# EAGLE design 2021 Deployment REVB (EAGLE 9.6.2)

## Sheet 1 of 2: Template
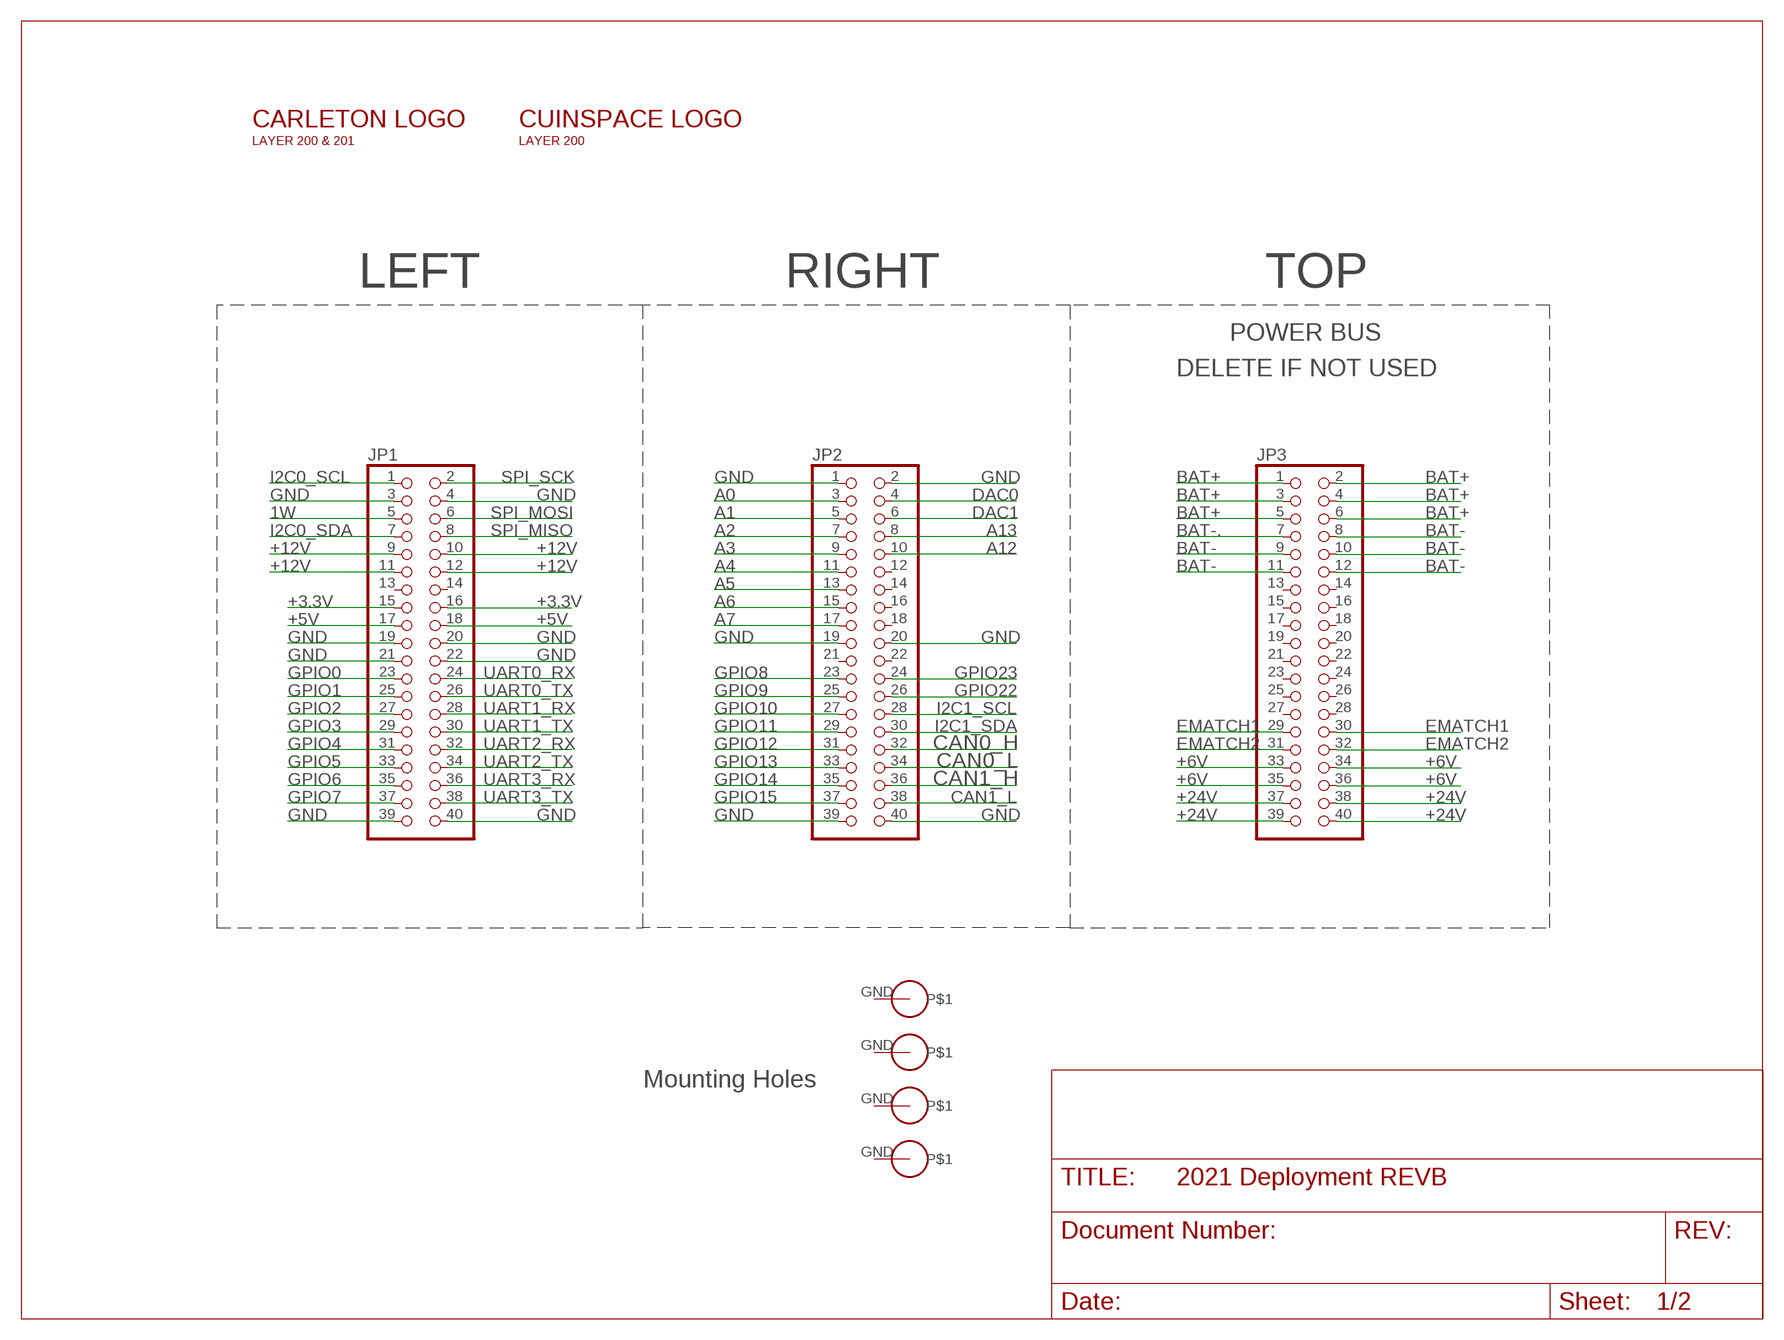
[diagram p0: schematic, sheet 1]

### Parts
$$U$1  PS/104-MOUNTING-HOLE  [PC/104-MOUNTING-HOLE]
JP1  PINHD-2X20  [2X20]
JP2  PINHD-2X20  [2X20]
JP3  PINHD-2X20  [2X20]
U$1  PS/104-MOUNTING-HOLE  [PC/104-MOUNTING-HOLE]
U$2  PS/104-MOUNTING-HOLE  [PC/104-MOUNTING-HOLE]
U$3  PS/104-MOUNTING-HOLE  [PC/104-MOUNTING-HOLE]
U$4  CARLETON3CM  [CARLETONU_3CM]
U$6  INSPACE3CM_L  [INSPACE_3CM_LETTERS]

### Nets
1W: JP1.5
+3.3V: JP1.15 JP1.16
+5V: JP1.17 JP1.18
+6V: JP3.33 JP3.34 JP3.35 JP3.36
+12V: JP1.9 JP1.10 JP1.11 JP1.12 ; also sheet 2
+24V: JP3.37 JP3.38 JP3.39 JP3.40
A0: JP2.3
A1: JP2.5
A2: JP2.7
A3: JP2.9
A4: JP2.11
A5: JP2.13
A6: JP2.15
A7: JP2.17
A12: JP2.10
A13: JP2.8
BAT+: JP3.1 JP3.2 JP3.3 JP3.4 JP3.5 JP3.6
BAT-: JP3.8 JP3.9 JP3.10 JP3.11 JP3.12
BAT-.: JP3.7
CAN0_H: JP2.32
CAN0_L: JP2.34
CAN1_H: JP2.36
CAN1_L: JP2.38
DAC0: JP2.4
DAC1: JP2.6
EMATCH1: JP3.29 JP3.30 ; also sheet 2
EMATCH2: JP3.31 JP3.32 ; also sheet 2
GND [New Class]: JP1.3 JP1.4 JP1.19 JP1.20 JP1.21 JP1.22 JP1.39 JP1.40 JP2.1 JP2.2 JP2.19 JP2.20 JP2.39 JP2.40 ; also sheet 2
GPIO0: JP1.23
GPIO1: JP1.25
GPIO2: JP1.27
GPIO3: JP1.29
GPIO4: JP1.31
GPIO5: JP1.33
GPIO6: JP1.35
GPIO7: JP1.37
GPIO8: JP2.23
GPIO9: JP2.25
GPIO10: JP2.27
GPIO11: JP2.29
GPIO12: JP2.31
GPIO13: JP2.33
GPIO14: JP2.35
GPIO15: JP2.37
GPIO22: JP2.26 ; also sheet 2
GPIO23: JP2.24 ; also sheet 2
I2C0_SCL: JP1.1
I2C0_SDA: JP1.7
I2C1_SCL: JP2.28
I2C1_SDA: JP2.30
SPI_MISO: JP1.8
SPI_MOSI: JP1.6
SPI_SCK: JP1.2
UART0_RX: JP1.24
UART0_TX: JP1.26
UART1_RX: JP1.28
UART1_TX: JP1.30
UART2_RX: JP1.32
UART2_TX: JP1.34
UART3_RX: JP1.36
UART3_TX: JP1.38
Unconnected: $$U$1.GND JP1.13 JP1.14 JP2.12 JP2.14 JP2.16 JP2.18 JP2.21 JP2.22 JP3.13 JP3.14 JP3.15 JP3.16 JP3.17 JP3.18 JP3.19 JP3.20 JP3.21 JP3.22 JP3.23 JP3.24 JP3.25 JP3.26 JP3.27 JP3.28 U$1.GND U$2.GND U$3.GND

### Notes on the sheet
- LEFT | RIGHT | TOP
- POWER BUS
- DELETE IF NOT USED
- Mounting Holes

## Sheet 2 of 2
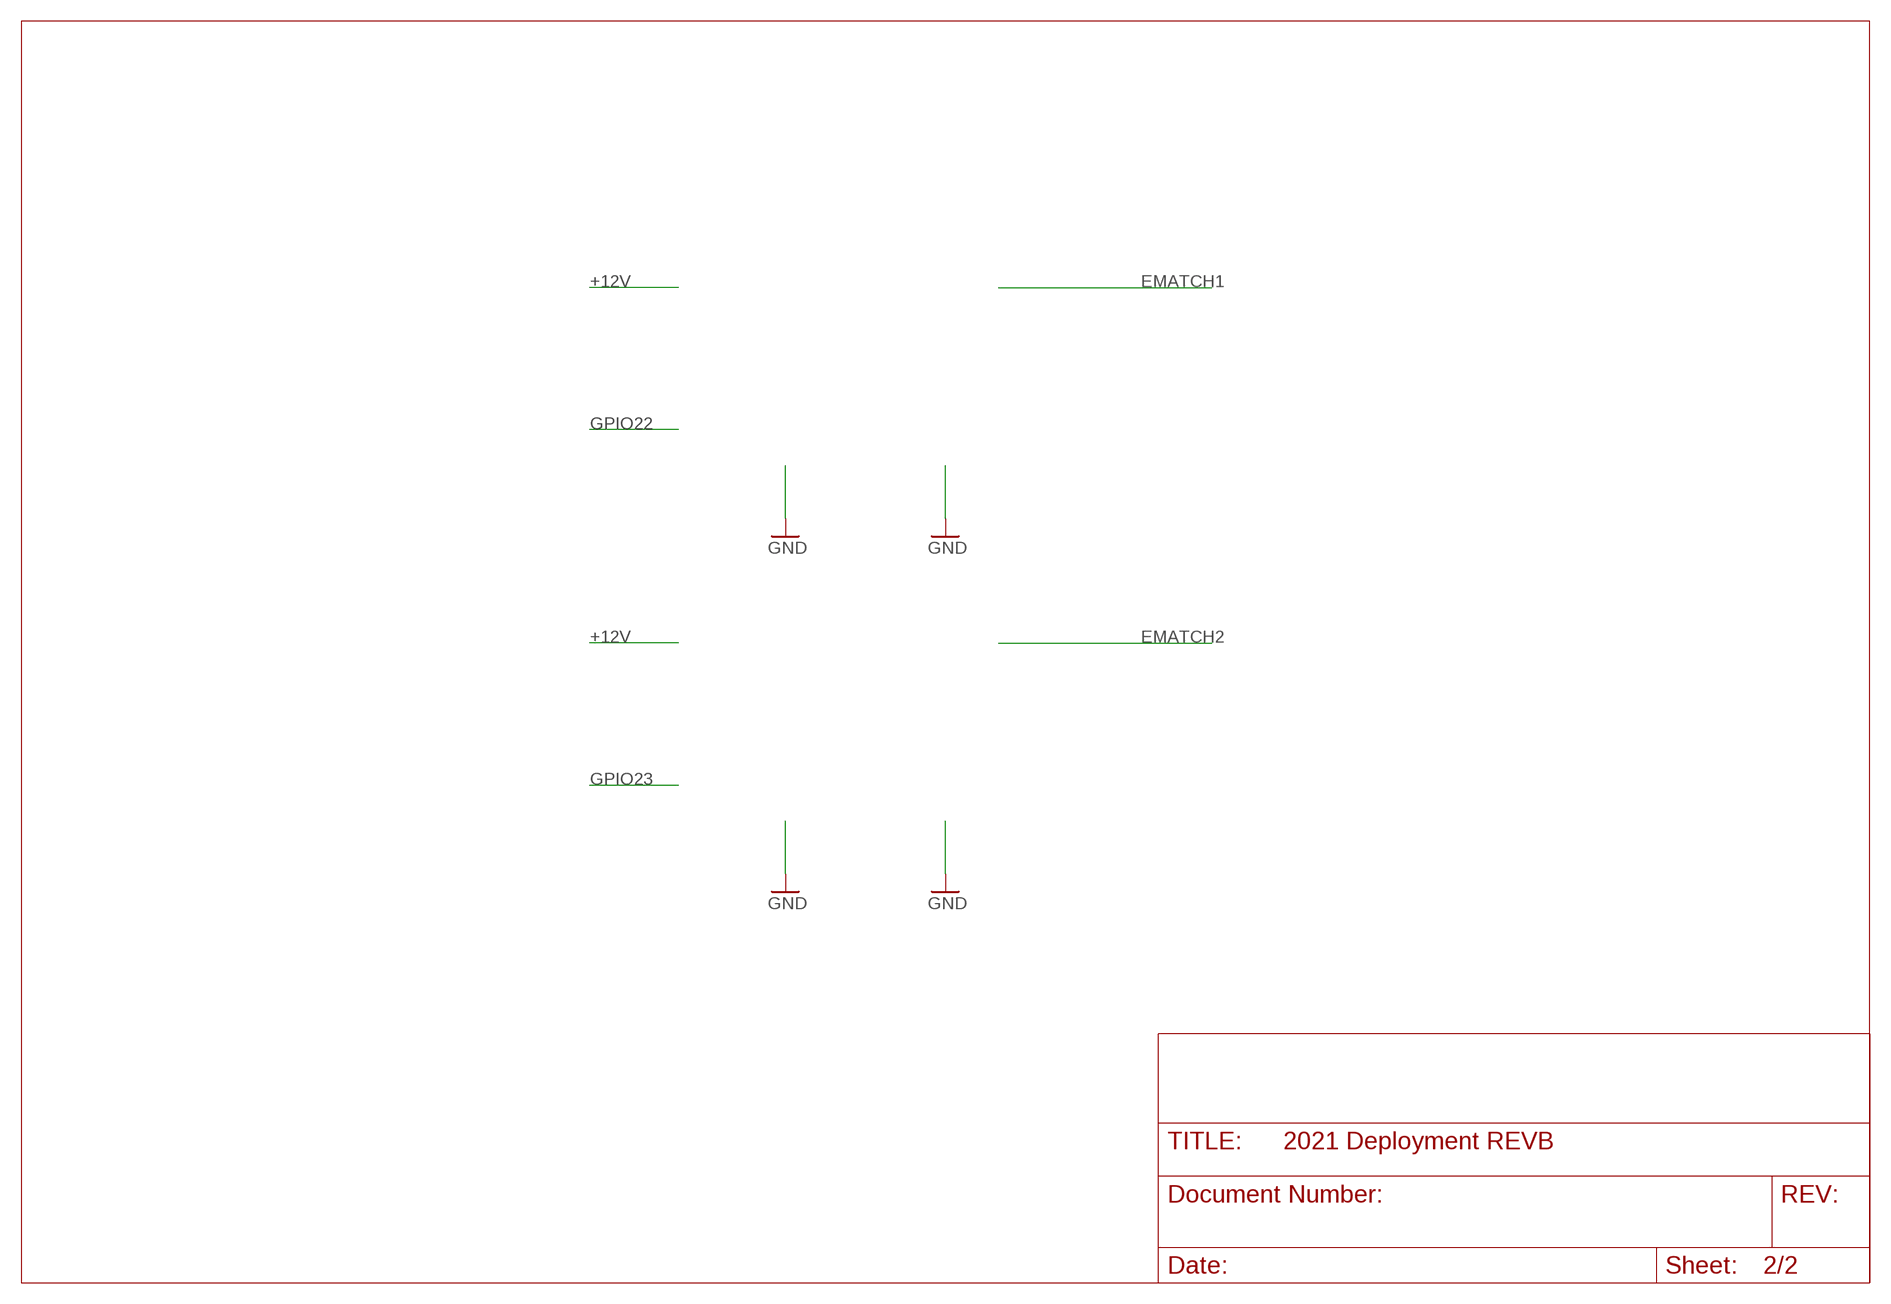
[diagram p1: schematic, sheet 2]

## Library data of the parts
$$U$1 U$1-U$3 = CU inSpace 2019 Parts:PS/104-MOUNTING-HOLE: Mounting hole for PC/104 board.
JP1-JP3 = pinhead:PINHD-2X20: PIN HEADER
U$4 = Logos:CARLETON
U$6 = Logos:INSPACE

## Net classes
2 diff pairs: width 0.254 mm

## Board
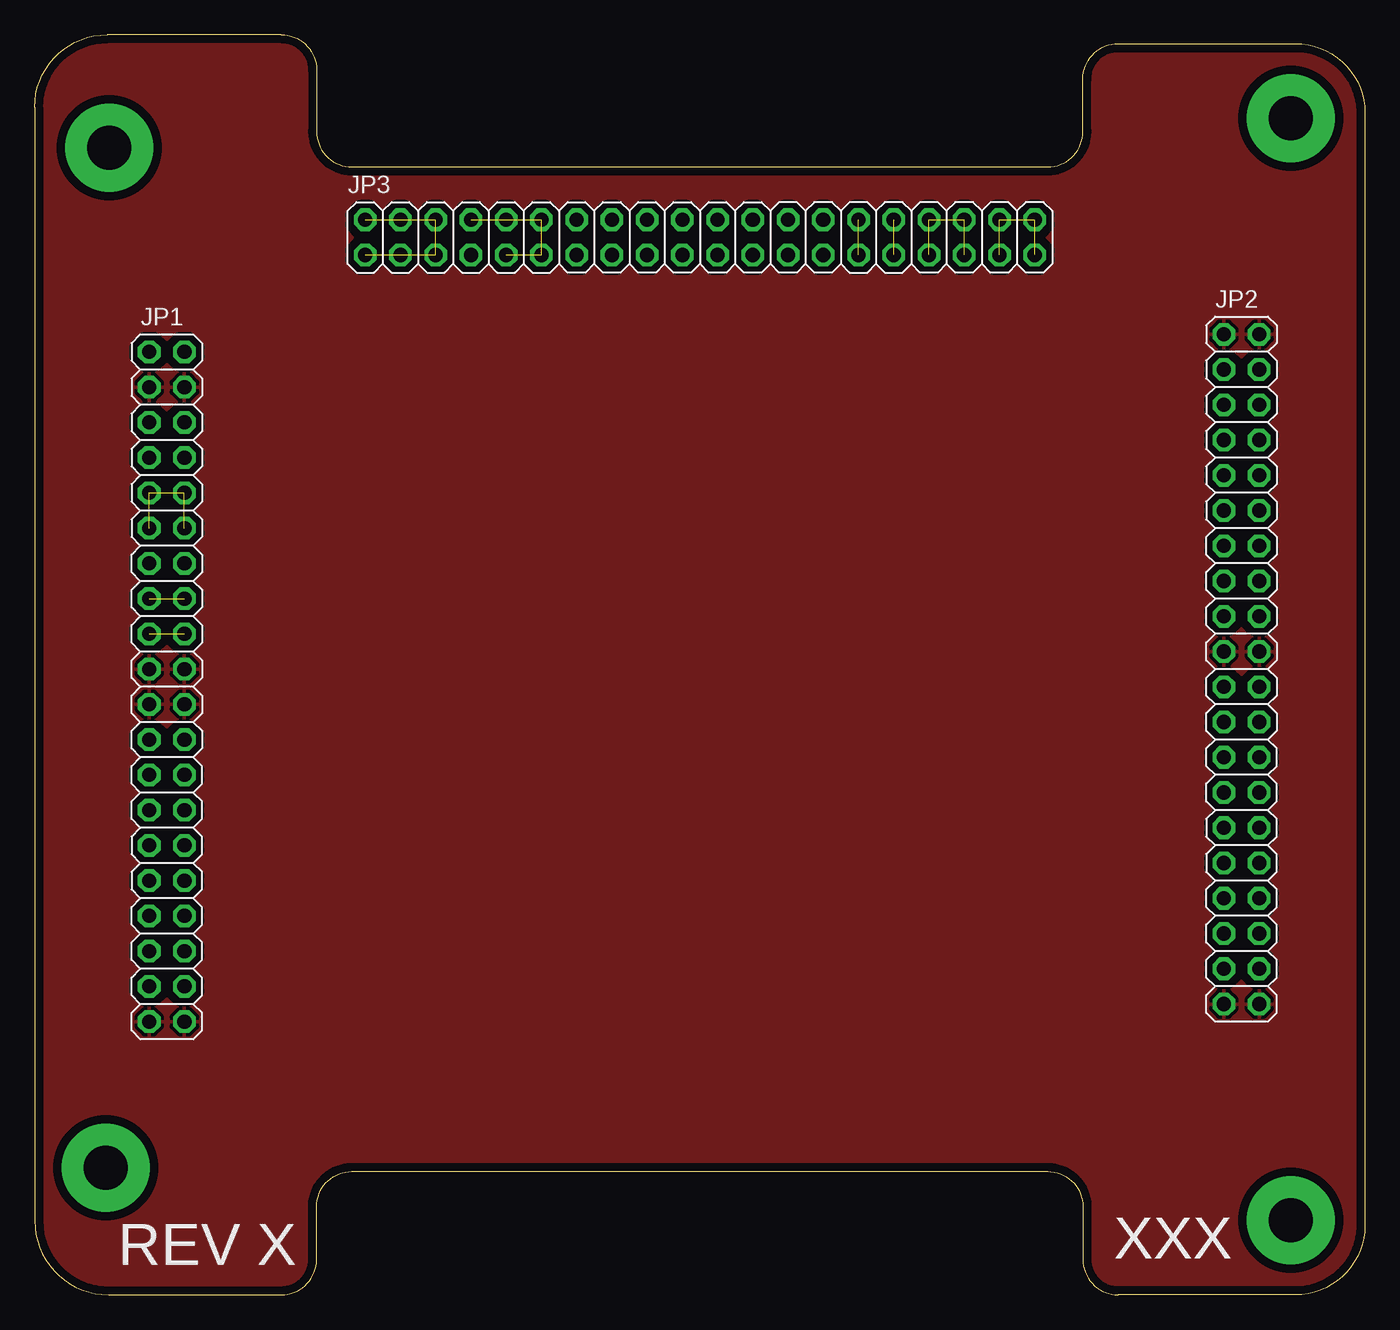
[diagram p2: board, top side]
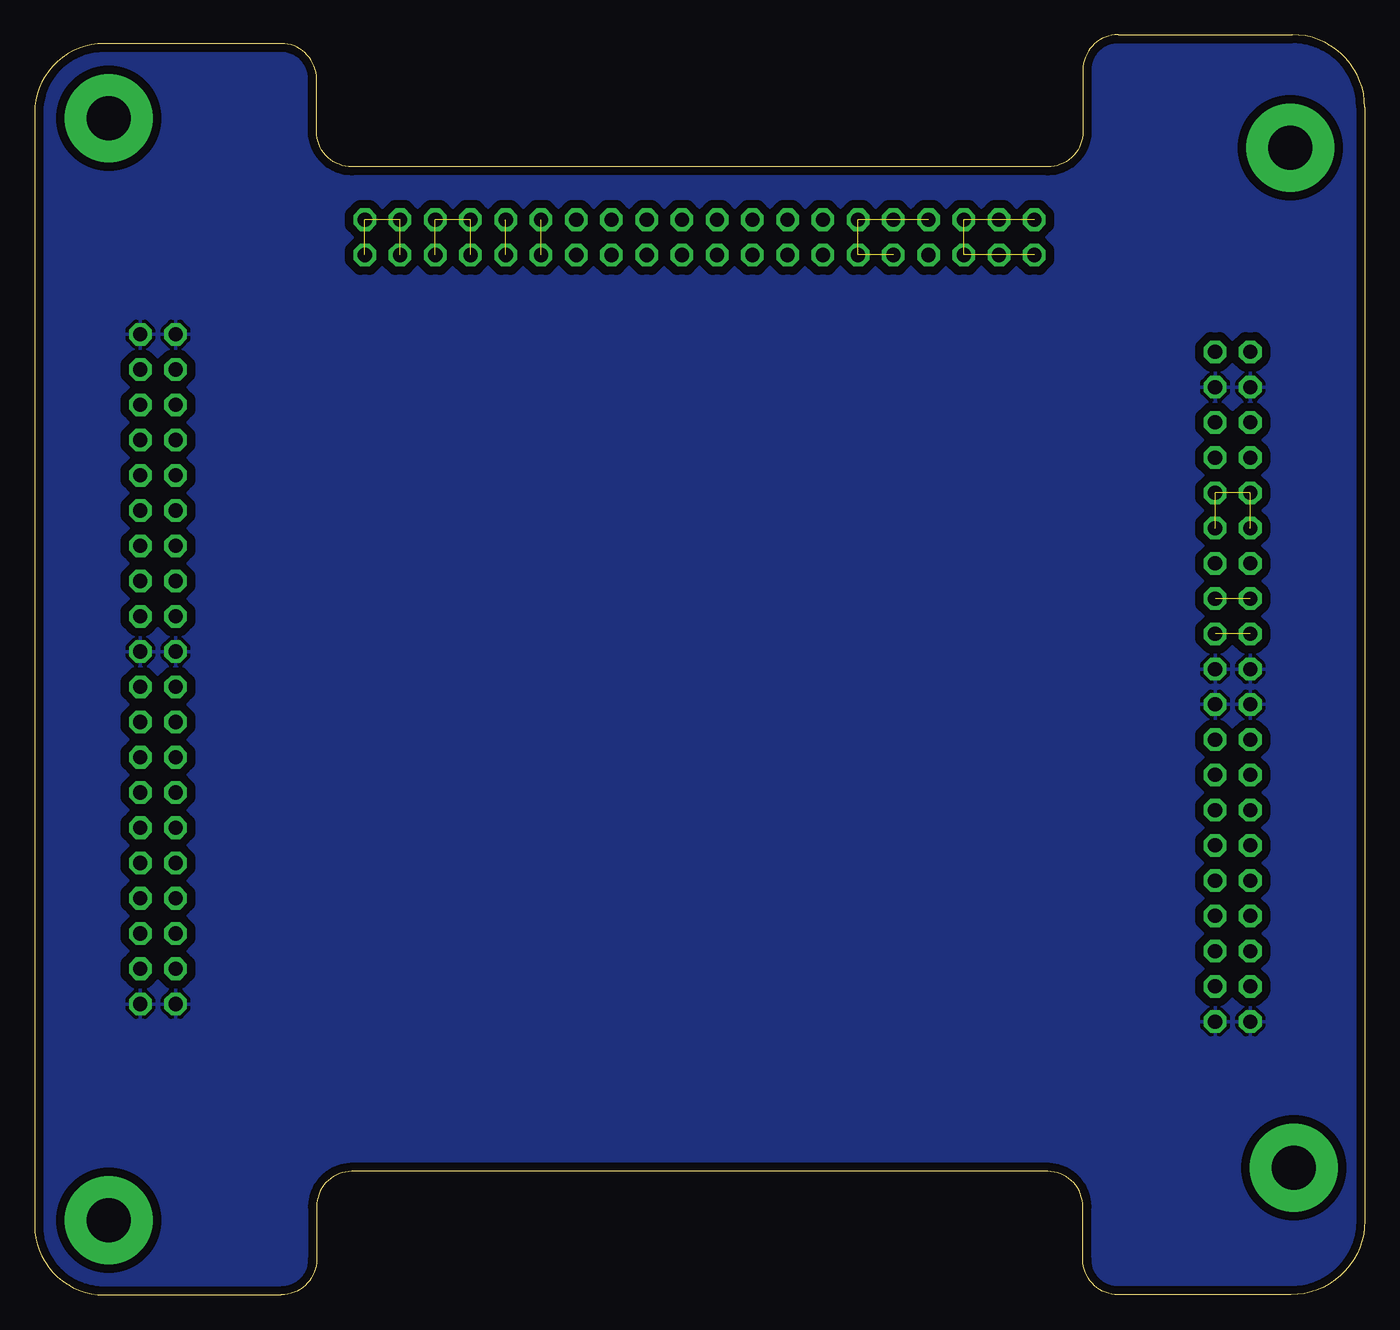
[diagram p3: board, bottom side, seen from below]

Size 95.89 x 90.81 mm. Coordinates in mm from the lower left corner, seen from the top.
Outline: 0,85.57 0,5.33 arc90 5.33,0 17.78,0 arc90 20.32,2.54 20.32,6.35 arc-90 22.86,8.89 73.03,8.89 arc-90 75.56,6.35 75.56,2.54 arc90 78.11,0 90.89,0 arc90 95.89,5 95.89,85.17 arc90 90.89,90.17 78.11,90.17 arc90 75.56,87.63 75.56,83.82 arc-90 73.03,81.28 22.86,81.28 arc-90 20.32,83.82 20.32,88.27 arc90 17.78,90.81 5.23,90.81 arc90 0,85.57
Copper layers (1*16): Top 0.035mm / dielectric 1.53mm / Bottom 0.035mm
Design rules "JLC 2 Layer": minimum track width 5mil, minimum drill 0.2mm, track to track 3.5mil, track to pad 3.5mil, pad to pad 5mil, via to via 10mil, smd to smd 0mil, copper to edge 10mil, drill to drill 10mil, minimum pad ring 12mil, minimum via ring 5mil, stop-mask expansion 4mil, vias tented up to drill 0mil, thermal gap 10mil

### Footprints (pad centres in the part's own frame; a part is rotated, then mirrored left to right if it is on the bottom)
PC/104-MOUNTING-HOLE = drill 3.175 pad 6.35: GND 0,0
2X20 = drill 1.016 octagon: 1 -24.13,-1.27; 2 -24.13,1.27; 3 -21.59,-1.27; 4 -21.59,1.27; 5 -19.05,-1.27; 6 -19.05,1.27; 7 -16.51,-1.27; 8 -16.51,1.27; 9 -13.97,-1.27; 10 -13.97,1.27; 11 -11.43,-1.27; 12 -11.43,1.27; 13 -8.89,-1.27; 14 -8.89,1.27; 15 -6.35,-1.27; 16 -6.35,1.27; 17 -3.81,-1.27; 18 -3.81,1.27; 19 -1.27,-1.27; 20 -1.27,1.27; 21 1.27,-1.27; 22 1.27,1.27; 23 3.81,-1.27; 24 3.81,1.27; 25 6.35,-1.27; 26 6.35,1.27; 27 8.89,-1.27; 28 8.89,1.27; 29 11.43,-1.27; 30 11.43,1.27; 31 13.97,-1.27; 32 13.97,1.27; 33 16.51,-1.27; 34 16.51,1.27; 35 19.05,-1.27; 36 19.05,1.27; 37 21.59,-1.27; 38 21.59,1.27; 39 24.13,-1.27; 40 24.13,1.27

### Placement (x,y rotation side)
$$U$1  5.13,9.17 0 top
JP1  9.53,43.81 270 top
JP2  87,45.09 270 top
JP3  47.96,76.2 0 top
U$1  90.55,84.79 0 top
U$2  5.36,82.65 0 top
U$3  90.55,5.36 0 top
U$4  34.3,-6.5 0 top  (outside the outline)
U$6  33.91,-12.47 0 top  (outside the outline)

### Tracks (layer width: path | path; a pad name or v marks a point on that pad's centre or on a via)
+3.3V  (1 unrouted)
+5V  (1 unrouted)
+6V  (3 unrouted)
+12V  (3 unrouted)
+24V  (3 unrouted)
BAT+  (5 unrouted)
BAT-  (4 unrouted)
EMATCH1  (1 unrouted)
EMATCH2  (1 unrouted)
GND
  pour Top (isolate 0.61): 0,0 0,90.81 93.98,90.81 95.89,90.81 95.89,0
  pour Top (isolate 0.61): 0,0 0,90.81 93.98,90.81 95.89,90.81 95.89,0
  pour Bottom (isolate 0.61): 0,0 0,90.81 93.98,90.81 95.89,90.81 95.89,0

### Text on the board
tPlace: YOUR NAME
tNames: XXX | REV X